# Altium schematic sheet Mosfets.SchDoc
size A3
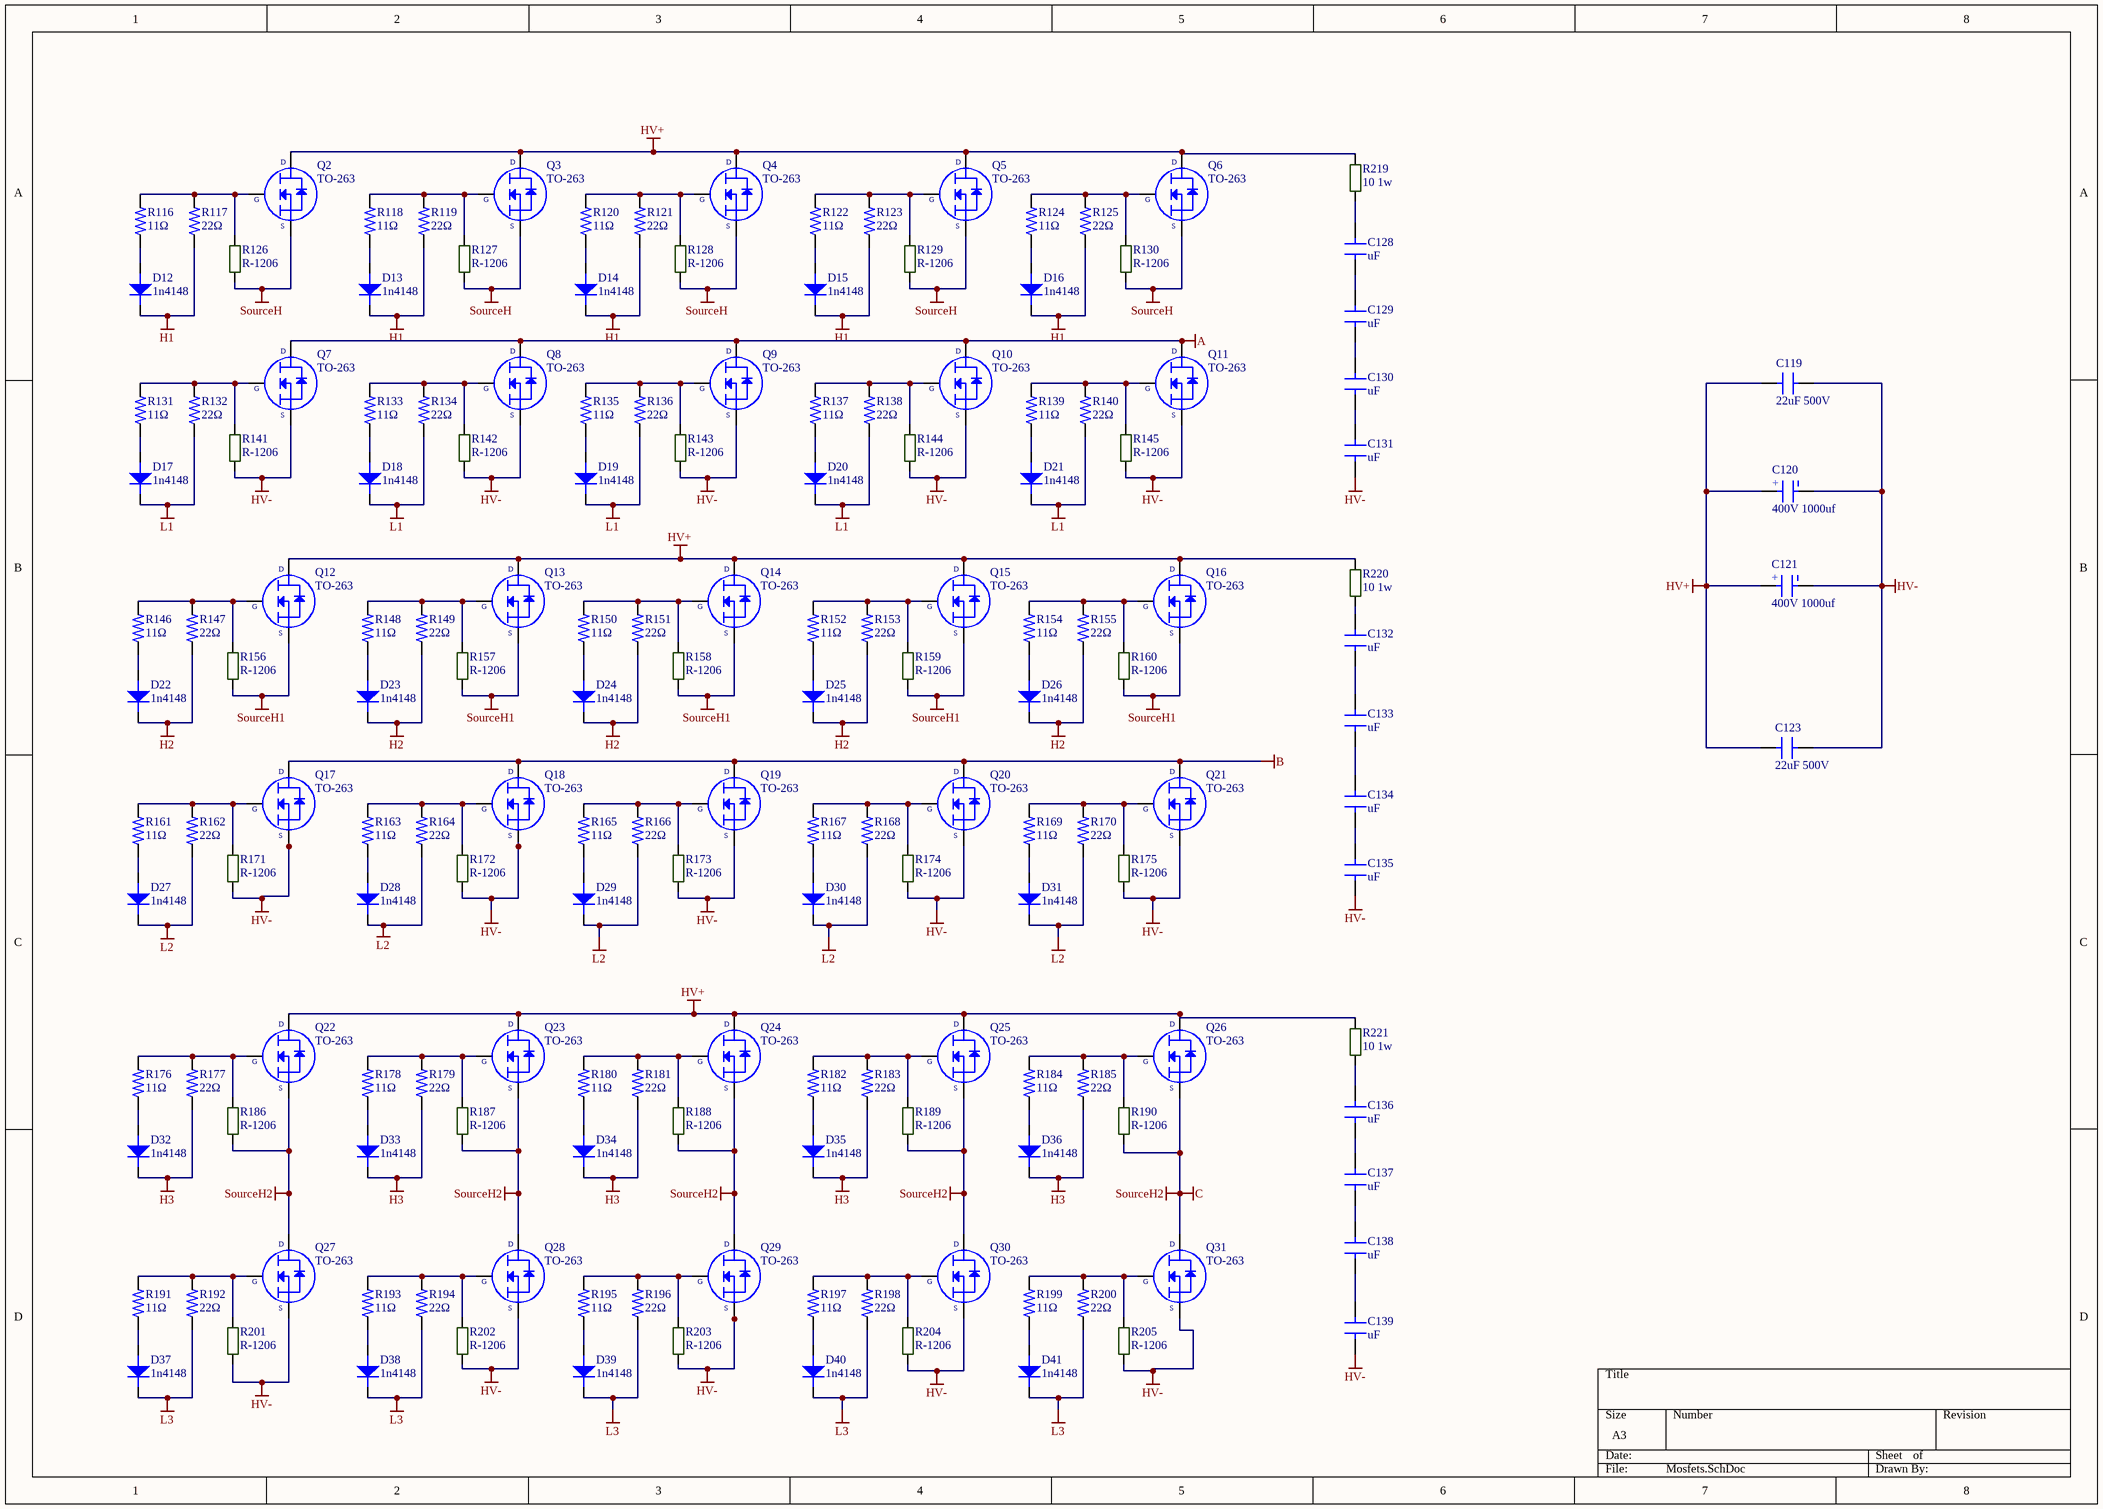
[diagram p0: Mosfets.SchDoc]

## Parts
C119  22uF 500V  [CAP.POL 22UF 500VDC - duplicate]
C120  400V 1000uf  [Koshin 63v 4700 cap]
C121  400V 1000uf  [Koshin 63v 4700 cap]
C123  22uF 500V  [CAP.POL 22UF 500VDC - duplicate]
C128  uF  [C-1206]
C129  uF  [C-1206]
C130  uF  [C-1206]
C131  uF  [C-1206]
C132  uF  [C-1206]
C133  uF  [C-1206]
C134  uF  [C-1206]
C135  uF  [C-1206]
C136  uF  [C-1206]
C137  uF  [C-1206]
C138  uF  [C-1206]
C139  uF  [C-1206]
D12  1n4148  [SOD123]
D13  1n4148  [SOD123]
D14  1n4148  [SOD123]
D15  1n4148  [SOD123]
D16  1n4148  [SOD123]
D17  1n4148  [SOD123]
D18  1n4148  [SOD123]
D19  1n4148  [SOD123]
D20  1n4148  [SOD123]
D21  1n4148  [SOD123]
D22  1n4148  [SOD123]
D23  1n4148  [SOD123]
D24  1n4148  [SOD123]
D25  1n4148  [SOD123]
D26  1n4148  [SOD123]
D27  1n4148  [SOD123]
D28  1n4148  [SOD123]
D29  1n4148  [SOD123]
D30  1n4148  [SOD123]
D31  1n4148  [SOD123]
D32  1n4148  [SOD123]
D33  1n4148  [SOD123]
D34  1n4148  [SOD123]
D35  1n4148  [SOD123]
D36  1n4148  [SOD123]
D37  1n4148  [SOD123]
D38  1n4148  [SOD123]
D39  1n4148  [SOD123]
D40  1n4148  [SOD123]
D41  1n4148  [SOD123]
Q2  TO-263  [DPAK_TO263]
Q3  TO-263  [DPAK_TO263]
Q4  TO-263  [DPAK_TO263]
Q5  TO-263  [DPAK_TO263]
Q6  TO-263  [DPAK_TO263]
Q7  TO-263  [DPAK_TO263]
Q8  TO-263  [DPAK_TO263]
Q9  TO-263  [DPAK_TO263]
Q10  TO-263  [DPAK_TO263]
Q11  TO-263  [DPAK_TO263]
Q12  TO-263  [DPAK_TO263]
Q13  TO-263  [DPAK_TO263]
Q14  TO-263  [DPAK_TO263]
Q15  TO-263  [DPAK_TO263]
Q16  TO-263  [DPAK_TO263]
Q17  TO-263  [DPAK_TO263]
Q18  TO-263  [DPAK_TO263]
Q19  TO-263  [DPAK_TO263]
Q20  TO-263  [DPAK_TO263]
Q21  TO-263  [DPAK_TO263]
Q22  TO-263  [DPAK_TO263]
Q23  TO-263  [DPAK_TO263]
Q24  TO-263  [DPAK_TO263]
Q25  TO-263  [DPAK_TO263]
Q26  TO-263  [DPAK_TO263]
Q27  TO-263  [DPAK_TO263]
Q28  TO-263  [DPAK_TO263]
Q29  TO-263  [DPAK_TO263]
Q30  TO-263  [DPAK_TO263]
Q31  TO-263  [DPAK_TO263]
R116  11Ω  [R-1206W]
R117  22Ω  [R-1206W]
R118  11Ω  [R-1206W]
R119  22Ω  [R-1206W]
R120  11Ω  [R-1206W]
R121  22Ω  [R-1206W]
R122  11Ω  [R-1206W]
R123  22Ω  [R-1206W]
R124  11Ω  [R-1206W]
R125  22Ω  [R-1206W]
R126  R-1206  [R-1206]
R127  R-1206  [R-1206]
R128  R-1206  [R-1206]
R129  R-1206  [R-1206]
R130  R-1206  [R-1206]
R131  11Ω  [R-1206W]
R132  22Ω  [R-1206W]
R133  11Ω  [R-1206W]
R134  22Ω  [R-1206W]
R135  11Ω  [R-1206W]
R136  22Ω  [R-1206W]
R137  11Ω  [R-1206W]
R138  22Ω  [R-1206W]
R139  11Ω  [R-1206W]
R140  22Ω  [R-1206W]
R141  R-1206  [R-1206]
R142  R-1206  [R-1206]
R143  R-1206  [R-1206]
R144  R-1206  [R-1206]
R145  R-1206  [R-1206]
R146  11Ω  [R-1206W]
R147  22Ω  [R-1206W]
R148  11Ω  [R-1206W]
R149  22Ω  [R-1206W]
R150  11Ω  [R-1206W]
R151  22Ω  [R-1206W]
R152  11Ω  [R-1206W]
R153  22Ω  [R-1206W]
R154  11Ω  [R-1206W]
R155  22Ω  [R-1206W]
R156  R-1206  [R-1206]
R157  R-1206  [R-1206]
R158  R-1206  [R-1206]
R159  R-1206  [R-1206]
R160  R-1206  [R-1206]
R161  11Ω  [R-1206W]
R162  22Ω  [R-1206W]
R163  11Ω  [R-1206W]
R164  22Ω  [R-1206W]
R165  11Ω  [R-1206W]
R166  22Ω  [R-1206W]
R167  11Ω  [R-1206W]
R168  22Ω  [R-1206W]
R169  11Ω  [R-1206W]
R170  22Ω  [R-1206W]
R171  R-1206  [R-1206]
R172  R-1206  [R-1206]
R173  R-1206  [R-1206]
R174  R-1206  [R-1206]
R175  R-1206  [R-1206]
R176  11Ω  [R-1206W]
R177  22Ω  [R-1206W]
R178  11Ω  [R-1206W]
R179  22Ω  [R-1206W]
R180  11Ω  [R-1206W]
R181  22Ω  [R-1206W]
R182  11Ω  [R-1206W]
R183  22Ω  [R-1206W]
R184  11Ω  [R-1206W]
R185  22Ω  [R-1206W]
R186  R-1206  [R-1206]
R187  R-1206  [R-1206]
R188  R-1206  [R-1206]
R189  R-1206  [R-1206]
R190  R-1206  [R-1206]
R191  11Ω  [R-1206W]
R192  22Ω  [R-1206W]
R193  11Ω  [R-1206W]
R194  22Ω  [R-1206W]
R195  11Ω  [R-1206W]
R196  22Ω  [R-1206W]
R197  11Ω  [R-1206W]
R198  22Ω  [R-1206W]
R199  11Ω  [R-1206W]
R200  22Ω  [R-1206W]
R201  R-1206  [R-1206]
R202  R-1206  [R-1206]
R203  R-1206  [R-1206]
R204  R-1206  [R-1206]
R205  R-1206  [R-1206]
R219  10 1w  [R-2512]
R220  10 1w  [R-2512]
R221  10 1w  [R-2512]

## Nets
A: Q7.3 Q8.3 Q9.3 Q10.3 Q11.3
B: Q17.3 Q18.3 Q19.3 Q20.3 Q21.3
C: Q22.2 Q23.2 Q24.2 Q25.2 Q26.2 Q27.3 Q28.3 Q29.3 Q30.3 Q31.3 R186.1 R187.1 R188.1 R189.1 R190.1  [also labelled SourceH2]
H1: D12.k D13.k D14.k D15.k D16.k R117.1 R119.1 R121.1 R123.1 R125.1
H2: D22.k D23.k D24.k D25.k D26.k R147.1 R149.1 R151.1 R153.1 R155.1
H3: D32.k D33.k D34.k D35.k D36.k R177.1 R179.1 R181.1 R183.1 R185.1
HV+: C119.1 C120.2 C121.2 C123.1 Q2.3 Q3.3 Q4.3 Q5.3 Q6.3 Q12.3 Q13.3 Q14.3 Q15.3 Q16.3 Q22.3 Q23.3 Q24.3 Q25.3 Q26.3 R219.2 R220.2 R221.2
HV-: C119.2 C120.1 C121.1 C123.2 C135.1 C139.1 Q7.2 Q8.2 Q9.2 Q10.2 Q11.2 Q17.2 Q18.2 Q19.2 Q20.2 Q21.2 Q27.2 Q28.2 Q29.2 Q30.2 Q31.2 R141.1 R142.1 R143.1 R144.1 R145.1 R171.1 R172.1 R173.1 R174.1 R175.1 R201.1 R202.1 R203.1 R204.1 R205.1
L1: D17.k D18.k D19.k D20.k D21.k R132.1 R134.1 R136.1 R138.1 R140.1
L2: D27.k D28.k D29.k D30.k D31.k R162.1 R164.1 R166.1 R168.1 R170.1
L3: D37.k D38.k D39.k D40.k D41.k R192.1 R194.1 R196.1 R198.1 R200.1
SourceH: Q2.2 Q3.2 Q4.2 Q5.2 Q6.2 R126.1 R127.1 R128.1 R129.1 R130.1
SourceH1: Q12.2 Q13.2 Q14.2 Q15.2 Q16.2 R156.1 R157.1 R158.1 R159.1 R160.1
NetC128_1: C128.1 C129.2
NetC128_2: C128.2 R219.1
NetC129_1: C129.1 C130.2
NetC130_1: C130.1 C131.2
NetC132_1: C132.1 C133.2
NetC132_2: C132.2 R220.1
NetC133_1: C133.1 C134.2
NetC134_1: C134.1 C135.2
NetC136_1: C136.1 C137.2
NetC136_2: C136.2 R221.1
NetC137_1: C137.1 C138.2
NetC138_1: C138.1 C139.2
NetD12_a: D12.a R116.1
NetD13_a: D13.a R118.1
NetD14_a: D14.a R120.1
NetD15_a: D15.a R122.1
NetD16_a: D16.a R124.1
NetD17_a: D17.a R131.1
NetD18_a: D18.a R133.1
NetD19_a: D19.a R135.1
NetD20_a: D20.a R137.1
NetD21_a: D21.a R139.1
NetD22_a: D22.a R146.1
NetD23_a: D23.a R148.1
NetD24_a: D24.a R150.1
NetD25_a: D25.a R152.1
NetD26_a: D26.a R154.1
NetD27_a: D27.a R161.1
NetD28_a: D28.a R163.1
NetD29_a: D29.a R165.1
NetD30_a: D30.a R167.1
NetD31_a: D31.a R169.1
NetD32_a: D32.a R176.1
NetD33_a: D33.a R178.1
NetD34_a: D34.a R180.1
NetD35_a: D35.a R182.1
NetD36_a: D36.a R184.1
NetD37_a: D37.a R191.1
NetD38_a: D38.a R193.1
NetD39_a: D39.a R195.1
NetD40_a: D40.a R197.1
NetD41_a: D41.a R199.1
NetQ2_1: Q2.1 R116.2 R117.2 R126.2
NetQ3_1: Q3.1 R118.2 R119.2 R127.2
NetQ4_1: Q4.1 R120.2 R121.2 R128.2
NetQ5_1: Q5.1 R122.2 R123.2 R129.2
NetQ6_1: Q6.1 R124.2 R125.2 R130.2
NetQ7_1: Q7.1 R131.2 R132.2 R141.2
NetQ8_1: Q8.1 R133.2 R134.2 R142.2
NetQ9_1: Q9.1 R135.2 R136.2 R143.2
NetQ10_1: Q10.1 R137.2 R138.2 R144.2
NetQ11_1: Q11.1 R139.2 R140.2 R145.2
NetQ12_1: Q12.1 R146.2 R147.2 R156.2
NetQ13_1: Q13.1 R148.2 R149.2 R157.2
NetQ14_1: Q14.1 R150.2 R151.2 R158.2
NetQ15_1: Q15.1 R152.2 R153.2 R159.2
NetQ16_1: Q16.1 R154.2 R155.2 R160.2
NetQ17_1: Q17.1 R161.2 R162.2 R171.2
NetQ18_1: Q18.1 R163.2 R164.2 R172.2
NetQ19_1: Q19.1 R165.2 R166.2 R173.2
NetQ20_1: Q20.1 R167.2 R168.2 R174.2
NetQ21_1: Q21.1 R169.2 R170.2 R175.2
NetQ22_1: Q22.1 R176.2 R177.2 R186.2
NetQ23_1: Q23.1 R178.2 R179.2 R187.2
NetQ24_1: Q24.1 R180.2 R181.2 R188.2
NetQ25_1: Q25.1 R182.2 R183.2 R189.2
NetQ26_1: Q26.1 R184.2 R185.2 R190.2
NetQ27_1: Q27.1 R191.2 R192.2 R201.2
NetQ28_1: Q28.1 R193.2 R194.2 R202.2
NetQ29_1: Q29.1 R195.2 R196.2 R203.2
NetQ30_1: Q30.1 R197.2 R198.2 R204.2
NetQ31_1: Q31.1 R199.2 R200.2 R205.2

Not connected (* = marked no-connect by the designer): C131 1

## Notes on the sheet
- Labels drawn without touching a wire or pin: HV-
- (in symbol Aluminum Electrolytic Capacitors) +
- (in symbol TO-263) D; G; S

## Library data of the parts
C119 C123 = CAP.POL 22UF 500VDC: ComponentLink1Description: https://www.ozdisan.com/pasif-komponentler/kondansatorler/film-kondansatorler/C3D2H226JB00C00; ComponentLink1URL: https://www.ozdisan.com/pasif-komponentler/kondansatorler/film-kondansatorler/C3D2H226JB00C00
C120 C121 = Aluminum Electrolytic Capacitors: Manufacturer: Nichicon; Manufacturer Part Number: LKS1J472MESZ; Capacitance: 4.7mF; Voltage Rating: 63V; Tolerance: 20%; Ripple Current: 3A; Life (Hours): 1000Hour; Supplier 1: Mouser; RoHS: Yes; Mount: Through Hole; Case/Package: Radial; Min Operating Temperature: -40°C; Max Operating Temperature: 85°C; Package Quantity: 250; Packaging: Bulk; Voltage Rating (DC): 63V; Termination: Snap in; Diameter: 22mm; Length: 45mm; Lead Pitch: 0.394inch; Height - Seated (Max): 1.772inch; Supplier Part Number 1: 647-LKS1J472MESZ; ComponentLink2Description: https://www.ozdisan.com/pasif-komponentler/kondansatorler/aluminyum-kondansatorler/PKL5-063V472MM450; ComponentLink2URL: https://www.ozdisan.com/pasif-komponentler/kondansatorler/aluminyum-kondansatorler/PKL5-063V472MM450
C128-C139 = C-1206
D12-D41 = 1N4148W-E3-18: Diode Small Signal Switching 100V 0.15A 2-Pin SOD-123 T/R; Manufacturer: Vishay; Recovery Time: 4ns; Max Power Dissipation: 350mW; Forward Current: 150mA; Max Surge Current: 2A; Forward Voltage: 1.2V; Max Reverse Leakage Current: 5uA; Element Configuration: Single; Max Reverse Voltage (DC): 75V; Peak Reverse Current: 100uA; Supplier 1: Allied Electronics; Manufacturer Part Number: 1N4148W-E3-18; RoHS: Yes; Stock 1: 6838; Pricing 1: 1 = 0.03900, 25 = 0.03800, 100 = 0.03600, 250 = 0.03400, 500 = 0.03200, 1000 = 0.03100, 2500 = 0.02900 (USD); Mount: Surface Mount; Number of Pins: 2; Weight: 0.000363oz; Contact Plating: Tin; Min Operating Temperature: -55°C; Max Operating Temperature: 150°C; Packaging: Tape and Reel; Package Quantity: 10000; Average Rectified Current: 150mA; Reverse Recovery Time: 4ns; Power Dissipation: 350mW; Max Repetitive Reverse Voltage (Vrrm): 100V; Peak Non-Repetitive Surge Current: 2A; Length: 2.85mm; Height: 1.25mm; Width: 1.7mm; Radiation Hardening: No; Lead Free: Lead Free; ComponentLink1URL: https://datasheet.ciiva.com/29885/1n4148w-29885941.pdf?src-supplier=Avnet; ComponentLink1Description: https://datasheet.ciiva.com/29885/1n4148w-29885941.pdf?src-supplier=Avnet; ComponentLink2URL: https://datasheet.ciiva.com/29593/1n4148w-29593113.pdf?src-supplier=Digi-Key; ComponentLink2Description: https://datasheet.ciiva.com/29593/1n4148w-29593113.pdf?src-supplier=Digi-Key; ComponentLink3URL: https://datasheet.ciiva.com/29593/1n4148w-29593111.pdf?src-supplier=Digi-Key; ComponentLink3Description: https://datasheet.ciiva.com/29593/1n4148w-29593111.pdf?src-supplier=Digi-Key; ComponentLink4URL: https://datasheet.ciiva.com/29593/1n4148w-29593112.pdf?src-supplier=Digi-Key; ComponentLink4Description: https://datasheet.ciiva.com/29593/1n4148w-29593112.pdf?src-supplier=Digi-Key; Supplier Part Number 1: 70061597
R116 R118 R120 R122 R124 R131 R133 R135 R137 R139 R146 R148 R150 R152 R154 R161 R163 R165 R167 R169 R176 R178 R180 R182 R184 R191 R193 R195 R197 R199 = RES 11Ω 1206: CRG1206 1% 11R; MP: 1623463-1; Package: None; Price: None; Value: *; Availability: Unavailable
R117 R119 R121 R123 R125 R132 R134 R136 R138 R140 R147 R149 R151 R153 R155 R162 R164 R166 R168 R170 R177 R179 R181 R183 R185 R192 R194 R196 R198 R200 = RES 22Ω 1206: CRG1206 1% 22R; MP: 1623463-1; Package: None; Price: None; Value: *; Availability: Unavailable
R126-R130 R141-R145 R156-R160 R171-R175 R186-R190 R201-R205 = R-1206: Res1206
R219-R221 = R-2512